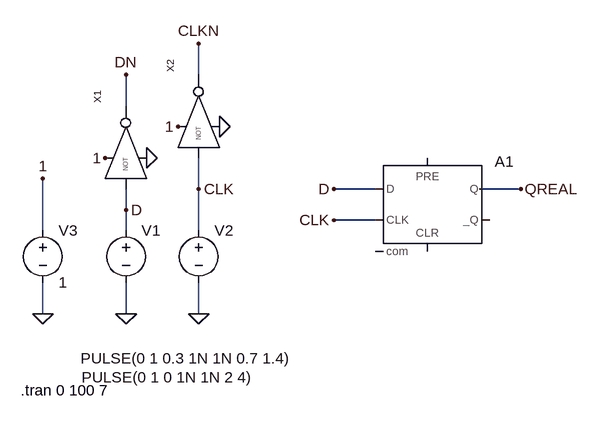
[diagram p0: schematic Draft51.asc]
Draft51.asc, the LTspice schematic file:
Version 4
SHEET 1 880 680
WIRE -128 -48 -128 -96
WIRE -240 0 -240 -48
WIRE -128 128 -128 80
WIRE 144 128 80 128
WIRE 368 128 304 128
WIRE -240 160 -240 128
WIRE 144 176 80 176
WIRE -368 192 -368 112
WIRE -240 192 -240 160
WIRE -128 192 -128 128
WIRE -368 320 -368 272
WIRE -240 320 -240 272
WIRE -128 320 -128 272
FLAG 80 128 D
FLAG 80 176 CLK
FLAG 368 128 QREAL
FLAG -272 80 1
FLAG -368 112 1
FLAG -208 80 0
FLAG -368 320 0
FLAG -240 320 0
FLAG -128 320 0
FLAG -240 160 D
FLAG -240 -48 DN
FLAG -128 128 CLK
FLAG -160 32 1
FLAG -96 32 0
FLAG -128 -96 CLKN
SYMBOL Digital\\dflop 224 80 R0
SYMATTR InstName A1
SYMBOL voltage -240 176 R0
WINDOW 3 -70 213 Left 2
WINDOW 123 0 0 Left 0
WINDOW 39 0 0 Left 0
SYMATTR InstName V1
SYMATTR Value PULSE(0 1 0.3 1N 1N 0.7 1.4)
SYMBOL voltage -128 176 R0
WINDOW 3 -180 242 Left 2
WINDOW 123 0 0 Left 0
WINDOW 39 0 0 Left 0
SYMATTR InstName V2
SYMATTR Value PULSE(0 1 0 1N 1N 2 4)
SYMBOL NOT4 -224 64 R270
SYMATTR InstName X1
SYMBOL voltage -368 176 R0
WINDOW 123 0 0 Left 0
WINDOW 39 0 0 Left 0
SYMATTR InstName V3
SYMATTR Value 1
SYMBOL NOT4 -112 16 R270
SYMATTR InstName X2
TEXT -402 438 Left 2 !.tran 0 100 7

The netlist it stands for:
* Draft51.asc
A1 D 0 CLK 0 0 0 QREAL 0 DFLOP
V1 D 0 PULSE(0 1 0.3 1N 1N 0.7 1.4)
V2 CLK 0 PULSE(0 1 0 1N 1N 2 4)
XX1 D 1 0 DN NOT4  ; pins A VH VL OUT
V3 1 0 1
XX2 CLK 1 0 CLKN NOT4  ; pins A VH VL OUT
.tran 0 100 7
.backanno
.end

* Results of the author's LTspice run, read from the files saved beside the schematic
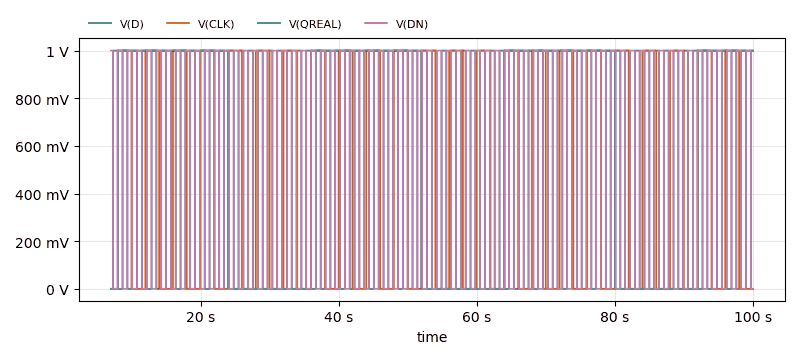
[diagram p1: Transient Analysis of Draft51.asc, plotted from the saved traces]
* Transient Analysis, 1 run:
*   V(D): min -1.689 µV, max 1 V, average 500 mV, rms 707.1 mV, last 1 V
*   V(CLK): min 0 V, max 1 V, average 494.6 mV, rms 703.3 mV, last 0 V
*   V(QREAL): min 0 V, max 1 V, average 602.2 mV, rms 776 mV, last 1 V
*   V(DN): min 0 V, max 1.001 V, average 500 mV, rms 707.1 mV, last 100.5 nV